# Altium schematic sheet Relay Board_Rev1-2 - Altium.schdoc
size 421 x 304 mm
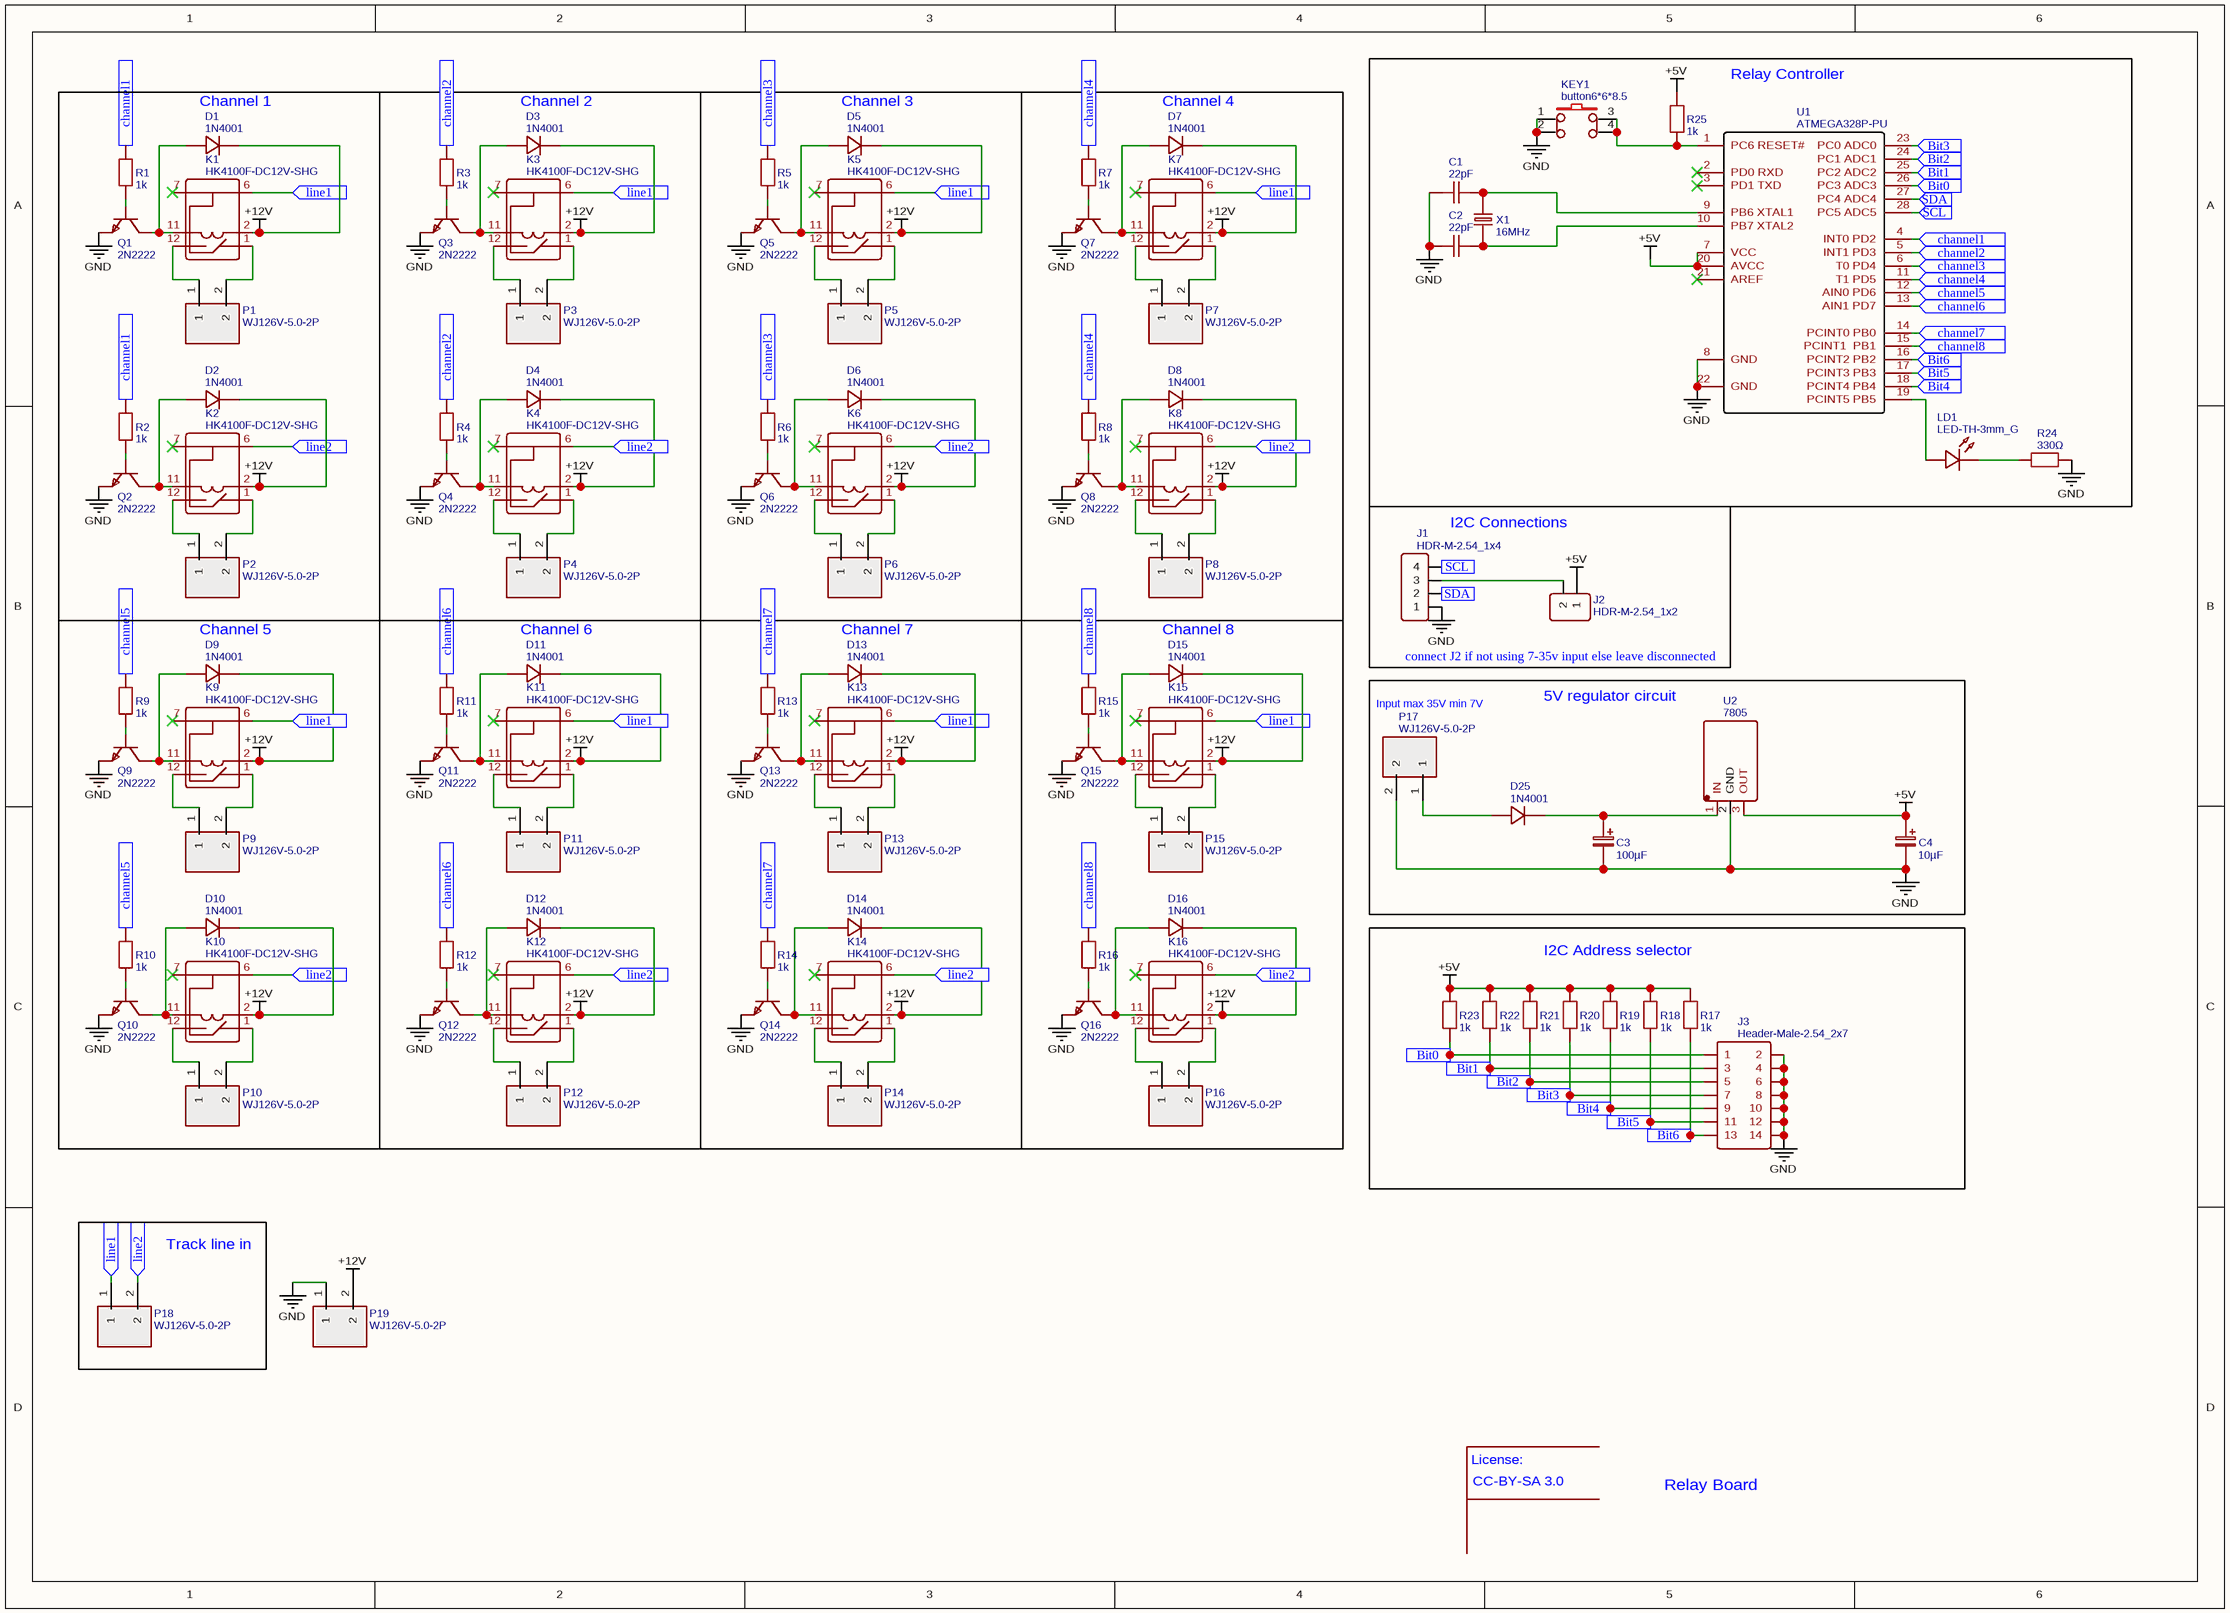
[diagram p0: Relay Board_Rev1-2 - Altium.schdoc]

## Parts
C1  22pF  [RAD-0.2]
C2  22pF  [RAD-0.2]
C3  100µF  [CAP-D3.0×F1.5]
C4  10µF  [CAP-D3.0×F1.5]
D1  1N4001  [DO-41_BD2.4-L4.7-P8.70-D0.9-RD]
D2  1N4001  [DO-41_BD2.4-L4.7-P8.70-D0.9-RD]
D3  1N4001  [DO-41_BD2.4-L4.7-P8.70-D0.9-RD]
D4  1N4001  [DO-41_BD2.4-L4.7-P8.70-D0.9-RD]
D5  1N4001  [DO-41_BD2.4-L4.7-P8.70-D0.9-RD]
D6  1N4001  [DO-41_BD2.4-L4.7-P8.70-D0.9-RD]
D7  1N4001  [DO-41_BD2.4-L4.7-P8.70-D0.9-RD]
D8  1N4001  [DO-41_BD2.4-L4.7-P8.70-D0.9-RD]
D9  1N4001  [DO-41_BD2.4-L4.7-P8.70-D0.9-RD]
D10  1N4001  [DO-41_BD2.4-L4.7-P8.70-D0.9-RD]
D11  1N4001  [DO-41_BD2.4-L4.7-P8.70-D0.9-RD]
D12  1N4001  [DO-41_BD2.4-L4.7-P8.70-D0.9-RD]
D13  1N4001  [DO-41_BD2.4-L4.7-P8.70-D0.9-RD]
D14  1N4001  [DO-41_BD2.4-L4.7-P8.70-D0.9-RD]
D15  1N4001  [DO-41_BD2.4-L4.7-P8.70-D0.9-RD]
D16  1N4001  [DO-41_BD2.4-L4.7-P8.70-D0.9-RD]
D25  1N4001  [DO-41_BD2.4-L4.7-P8.70-D0.9-RD]
J1  HDR-M-2.54_1x4  [HDR-M-2.54_1X4]
J2  HDR-M-2.54_1x2  [HDR-M-2.54_1X2]
J3  Header-Male-2.54_2x7  [HDR-TH_14P-P2.54-V-R2-C7-S2.54]
K1  HK4100F-DC12V-SHG  [RELAY-TH_HK4100F-DC12V-SHG]
K2  HK4100F-DC12V-SHG  [RELAY-TH_HK4100F-DC12V-SHG]
K3  HK4100F-DC12V-SHG  [RELAY-TH_HK4100F-DC12V-SHG]
K4  HK4100F-DC12V-SHG  [RELAY-TH_HK4100F-DC12V-SHG]
K5  HK4100F-DC12V-SHG  [RELAY-TH_HK4100F-DC12V-SHG]
K6  HK4100F-DC12V-SHG  [RELAY-TH_HK4100F-DC12V-SHG]
K7  HK4100F-DC12V-SHG  [RELAY-TH_HK4100F-DC12V-SHG]
K8  HK4100F-DC12V-SHG  [RELAY-TH_HK4100F-DC12V-SHG]
K9  HK4100F-DC12V-SHG  [RELAY-TH_HK4100F-DC12V-SHG]
K10  HK4100F-DC12V-SHG  [RELAY-TH_HK4100F-DC12V-SHG]
K11  HK4100F-DC12V-SHG  [RELAY-TH_HK4100F-DC12V-SHG]
K12  HK4100F-DC12V-SHG  [RELAY-TH_HK4100F-DC12V-SHG]
K13  HK4100F-DC12V-SHG  [RELAY-TH_HK4100F-DC12V-SHG]
K14  HK4100F-DC12V-SHG  [RELAY-TH_HK4100F-DC12V-SHG]
K15  HK4100F-DC12V-SHG  [RELAY-TH_HK4100F-DC12V-SHG]
K16  HK4100F-DC12V-SHG  [RELAY-TH_HK4100F-DC12V-SHG]
KEY1  button6*6*8.5  [KEY-TH_4P-L6.0-W6.0-P4.50]
LD1  LED-TH-3mm_G  [LED-TH_BD3.0_GREEN]
P1  WJ126V-5.0-2P  [WJ126V-5.0-2P]
P2  WJ126V-5.0-2P  [WJ126V-5.0-2P]
P3  WJ126V-5.0-2P  [WJ126V-5.0-2P]
P4  WJ126V-5.0-2P  [WJ126V-5.0-2P]
P5  WJ126V-5.0-2P  [WJ126V-5.0-2P]
P6  WJ126V-5.0-2P  [WJ126V-5.0-2P]
P7  WJ126V-5.0-2P  [WJ126V-5.0-2P]
P8  WJ126V-5.0-2P  [WJ126V-5.0-2P]
P9  WJ126V-5.0-2P  [WJ126V-5.0-2P]
P10  WJ126V-5.0-2P  [WJ126V-5.0-2P]
P11  WJ126V-5.0-2P  [WJ126V-5.0-2P]
P12  WJ126V-5.0-2P  [WJ126V-5.0-2P]
P13  WJ126V-5.0-2P  [WJ126V-5.0-2P]
P14  WJ126V-5.0-2P  [WJ126V-5.0-2P]
P15  WJ126V-5.0-2P  [WJ126V-5.0-2P]
P16  WJ126V-5.0-2P  [WJ126V-5.0-2P]
P17  WJ126V-5.0-2P  [WJ126V-5.0-2P]
P18  WJ126V-5.0-2P  [WJ126V-5.0-2P]
P19  WJ126V-5.0-2P  [WJ126V-5.0-2P]
Q1  2N2222  [TO-92-3_L4.9-W3.7-P1.27-L]
Q2  2N2222  [TO-92-3_L4.9-W3.7-P1.27-L]
Q3  2N2222  [TO-92-3_L4.9-W3.7-P1.27-L]
Q4  2N2222  [TO-92-3_L4.9-W3.7-P1.27-L]
Q5  2N2222  [TO-92-3_L4.9-W3.7-P1.27-L]
Q6  2N2222  [TO-92-3_L4.9-W3.7-P1.27-L]
Q7  2N2222  [TO-92-3_L4.9-W3.7-P1.27-L]
Q8  2N2222  [TO-92-3_L4.9-W3.7-P1.27-L]
Q9  2N2222  [TO-92-3_L4.9-W3.7-P1.27-L]
Q10  2N2222  [TO-92-3_L4.9-W3.7-P1.27-L]
Q11  2N2222  [TO-92-3_L4.9-W3.7-P1.27-L]
Q12  2N2222  [TO-92-3_L4.9-W3.7-P1.27-L]
Q13  2N2222  [TO-92-3_L4.9-W3.7-P1.27-L]
Q14  2N2222  [TO-92-3_L4.9-W3.7-P1.27-L]
Q15  2N2222  [TO-92-3_L4.9-W3.7-P1.27-L]
Q16  2N2222  [TO-92-3_L4.9-W3.7-P1.27-L]
R1  1k  [R_AXIAL-0.4]
R2  1k  [R_AXIAL-0.4]
R3  1k  [R_AXIAL-0.4]
R4  1k  [R_AXIAL-0.4]
R5  1k  [R_AXIAL-0.4]
R6  1k  [R_AXIAL-0.4]
R7  1k  [R_AXIAL-0.4]
R8  1k  [R_AXIAL-0.4]
R9  1k  [R_AXIAL-0.4]
R10  1k  [R_AXIAL-0.4]
R11  1k  [R_AXIAL-0.4]
R12  1k  [R_AXIAL-0.4]
R13  1k  [R_AXIAL-0.4]
R14  1k  [R_AXIAL-0.4]
R15  1k  [R_AXIAL-0.4]
R16  1k  [R_AXIAL-0.4]
R17  1k  [R_AXIAL-0.4]
R18  1k  [R_AXIAL-0.4]
R19  1k  [R_AXIAL-0.4]
R20  1k  [R_AXIAL-0.4]
R21  1k  [R_AXIAL-0.4]
R22  1k  [R_AXIAL-0.4]
R23  1k  [R_AXIAL-0.4]
R24  330Ω  [R_AXIAL-0.4]
R25  1k  [R_AXIAL-0.4]
U1  ATMEGA328P-PU  [DIP-28_L34.6-W7.3-P2.54-LS10.2-BL]
U2  7805  [TO-220-3_L10.0-W4.5-P2.54-L]
X1  16MHz  [HC-49US_L11.5-W4.5-P4.88]

## Blocks framed on the sheet
Relay Controller: C1 C2 KEY1 LD1 R24 R25 U1 X1
Channel 1: D1 D2 K1 K2 P1 P2 Q1 Q2 R1 R2
Channel 2: D3 D4 K3 K4 P3 P4 Q3 Q4 R3 R4
Channel 3: D5 D6 K5 K6 P5 P6 Q5 Q6 R5 R6
Channel 4: D7 D8 K7 K8 P7 P8 Q7 Q8 R7 R8
I2C Connections: J1 J2
Channel 5: D9 D10 K9 K10 P9 P10 Q9 Q10 R9 R10
Channel 6: D11 D12 K11 K12 P11 P12 Q11 Q12 R11 R12
Channel 7: D13 D14 K13 K14 P13 P14 Q13 Q14 R13 R14
Channel 8: D15 D16 K15 K16 P15 P16 Q15 Q16 R15 R16
5V regulator circuit: C3 C4 D25 P17 U2
I2C Address selector: J3 R17-R23
Track line in: P18

## Ports
Bit0 (in), Bit1 (in), Bit2 (in), Bit3 (in), Bit4 (in), Bit5 (in), Bit6 (in), channel1 (in), channel2 (in), channel3 (in), channel4 (in), channel5 (in), channel6 (in), channel7 (in), channel8 (in), line1 (in), line2 (in), SCL (in), SDA (in)

## Nets
+5V: C4.1 J2.1 R17.2 R18.2 R19.2 R20.2 R21.2 R22.2 R23.2 R25.2 U1.7(VCC) U1.20(AVCC) U2.3(OUT)
+12V: D1.1(K) D2.1(K) D3.1(K) D4.1(K) D5.1(K) D6.1(K) D7.1(K) D8.1(K) D9.1(K) D10.1(K) D11.1(K) D12.1(K) D13.1(K) D14.1(K) D15.1(K) D16.1(K) K1.2 K2.2 K3.2 K4.2 K5.2 K6.2 K7.2 K8.2 K9.2 K10.2 K11.2 K12.2 K13.2 K14.2 K15.2 K16.2 P19.2
GND: C1.1 C2.1 C3.2 C4.2 J1.1 J3.2 J3.4 J3.6 J3.8 J3.10 J3.12 J3.14 KEY1.1 KEY1.2 P17.2 P19.1 Q1.1(E) Q2.1(E) Q3.1(E) Q4.1(E) Q5.1(E) Q6.1(E) Q7.1(E) Q8.1(E) Q9.1(E) Q10.1(E) Q11.1(E) Q12.1(E) Q13.1(E) Q14.1(E) Q15.1(E) Q16.1(E) R24.2 U1.8(GND) U1.22(GND) U2.2(GND)
Bit0: J3.1 R23.1 U1.26(PC3_ADC3) ; port Bit0
Bit1: J3.3 R22.1 U1.25(PC2_ADC2) ; port Bit1
Bit2: J3.5 R21.1 U1.24(PC1_ADC1) ; port Bit2
Bit3: J3.7 R20.1 U1.23(PC0_ADC0) ; port Bit3
Bit4: J3.9 R19.1 U1.18(PCINT4_PB4) ; port Bit4
Bit5: J3.11 R18.1 U1.17(PCINT3_PB3) ; port Bit5
Bit6: J3.13 R17.1 U1.16(PCINT2_PB2) ; port Bit6
channel1: R1.2 R2.2 U1.4(INT0_PD2) ; port channel1
channel2: R3.2 R4.2 U1.5(INT1_PD3) ; port channel2
channel3: R5.2 R6.2 U1.6(T0_PD4) ; port channel3
channel4: R7.2 R8.2 U1.11(T1_PD5) ; port channel4
channel5: R9.2 R10.2 U1.12(AIN0_PD6) ; port channel5
channel6: R11.2 R12.2 U1.13(AIN1_PD7) ; port channel6
channel7: R13.2 R14.2 U1.14(PCINT0_PB0) ; port channel7
channel8: R15.2 R16.2 U1.15(PCINT1__PB1) ; port channel8
line1: K1.6 K3.6 K5.6 K7.6 K9.6 K11.6 K13.6 K15.6 P18.1 ; port line1
line2: K2.6 K4.6 K6.6 K8.6 K10.6 K12.6 K14.6 K16.6 P18.2 ; port line2
SCL: J1.4 U1.28(PC5_ADC5) ; port SCL
SDA: J1.2 U1.27(PC4_ADC4) ; port SDA
NetC1_2: C1.2 U1.9(PB6_XTAL1) X1.1
NetC2_2: C2.2 U1.10(PB7_XTAL2) X1.2
NetC3_1: C3.1 D25.1(K) U2.1(IN)
NetD1_2: D1.2(A) K1.11 Q1.3(C)
NetD2_2: D2.2(A) K2.11 Q2.3(C)
NetD3_2: D3.2(A) K3.11 Q3.3(C)
NetD4_2: D4.2(A) K4.11 Q4.3(C)
NetD5_2: D5.2(A) K5.11 Q5.3(C)
NetD6_2: D6.2(A) K6.11 Q6.3(C)
NetD7_2: D7.2(A) K7.11 Q7.3(C)
NetD8_2: D8.2(A) K8.11 Q8.3(C)
NetD9_2: D9.2(A) K9.11 Q9.3(C)
NetD10_2: D10.2(A) K10.11 Q10.3(C)
NetD11_2: D11.2(A) K11.11 Q11.3(C)
NetD12_2: D12.2(A) K12.11 Q12.3(C)
NetD13_2: D13.2(A) K13.11 Q13.3(C)
NetD14_2: D14.2(A) K14.11 Q14.3(C)
NetD15_2: D15.2(A) K15.11 Q15.3(C)
NetD16_2: D16.2(A) K16.11 Q16.3(C)
NetD25_2: D25.2(A) P17.1
NetJ1_3: J1.3 J2.2
NetK1_1: K1.1 P1.2
NetK1_12: K1.12 P1.1
NetK2_1: K2.1 P2.2
NetK2_12: K2.12 P2.1
NetK3_1: K3.1 P3.2
NetK3_12: K3.12 P3.1
NetK4_1: K4.1 P4.2
NetK4_12: K4.12 P4.1
NetK5_1: K5.1 P5.2
NetK5_12: K5.12 P5.1
NetK6_1: K6.1 P6.2
NetK6_12: K6.12 P6.1
NetK7_1: K7.1 P7.2
NetK7_12: K7.12 P7.1
NetK8_1: K8.1 P8.2
NetK8_12: K8.12 P8.1
NetK9_1: K9.1 P9.2
NetK9_12: K9.12 P9.1
NetK10_1: K10.1 P10.2
NetK10_12: K10.12 P10.1
NetK11_1: K11.1 P11.2
NetK11_12: K11.12 P11.1
NetK12_1: K12.1 P12.2
NetK12_12: K12.12 P12.1
NetK13_1: K13.1 P13.2
NetK13_12: K13.12 P13.1
NetK14_1: K14.1 P14.2
NetK14_12: K14.12 P14.1
NetK15_1: K15.1 P15.2
NetK15_12: K15.12 P15.1
NetK16_1: K16.1 P16.2
NetK16_12: K16.12 P16.1
NetKEY1_3: KEY1.3 KEY1.4 R25.1 U1.1(PC6_RESET#)
NetLD1_1: LD1.1 U1.19(PCINT5_PB5)
NetLD1_2: LD1.2 R24.1
NetQ1_2: Q1.2(B) R1.1
NetQ2_2: Q2.2(B) R2.1
NetQ3_2: Q3.2(B) R3.1
NetQ4_2: Q4.2(B) R4.1
NetQ5_2: Q5.2(B) R5.1
NetQ6_2: Q6.2(B) R6.1
NetQ7_2: Q7.2(B) R7.1
NetQ8_2: Q8.2(B) R8.1
NetQ9_2: Q9.2(B) R9.1
NetQ10_2: Q10.2(B) R10.1
NetQ11_2: Q11.2(B) R11.1
NetQ12_2: Q12.2(B) R12.1
NetQ13_2: Q13.2(B) R13.1
NetQ14_2: Q14.2(B) R14.1
NetQ15_2: Q15.2(B) R15.1
NetQ16_2: Q16.2(B) R16.1

Not connected (* = marked no-connect by the designer): K1 7*; K2 7*; K3 7*; K4 7*; K5 7*; K6 7*; K7 7*; K8 7*; K9 7*; K10 7*; K11 7*; K12 7*; K13 7*; K14 7*; K15 7*; K16 7*; U1 2(PD0_RXD)* 3(PD1_TXD)* 21(AREF)*

## Notes on the sheet
- connect J2 if not using 7-35v input else leave disconnected
- Input max 35V min 7V
- License:
- CC-BY-SA 3.0
- Relay Board

## Library data of the parts
C1 C2 = 22pF: nameAlias: Value(F); Contributor: LCEDA_Lib; spicePre: C; spiceSymbolName: C_RAD-0.2_US
C3 = 100µF: nameAlias: Value(F); Contributor: LCEDA_Lib; spicePre: C; spiceSymbolName: CE_TH_D3.0×F1.5_EU
C4 = 10µF: nameAlias: Value(F); Contributor: LCEDA_Lib; spicePre: C; spiceSymbolName: CE_TH_D3.0×F1.5_EU
D1-D16 D25 = 1N4001: BOM_Manufacturer: LRC; BOM_Supplier: LCSC; BOM_Manufacturer Part: 1N4001; BOM_Supplier Part: C82804; spicePre: D; spiceSymbolName: 1N4001
J1 = HDR-M-2.54_1x4: Contributor: LCEDA_Lib; BOM_Supplier Part: C124378; BOM_Supplier: LCSC; spicePre: J; spiceSymbolName: HDR-M-2.54_1x4
J2 = HDR-M-2.54_1x2: Contributor: LCEDA_Lib; BOM_Supplier Part: C124375; BOM_Supplier: LCSC; spicePre: J; spiceSymbolName: HDR-M-2.54_1x2
J3 = Header-Male-2.54_2x7: BOM_Manufacturer: BOOMELE; BOM_Manufacturer Part: Double row of needle2X7P 2.54mm; BOM_Supplier: LCSC; BOM_Supplier Part: C71397; spicePre: J; spiceSymbolName: Header-Male-2.54_2x7
K1-K16 = HK4100F-DC12V-SHG: BOM_Manufacturer: HUIKE; BOM_Supplier: LCSC; BOM_Manufacturer Part: HK4100F-DC12V-SHG; image: //image.lceda.cn/szlcsc/C13467.jpg; BOM_Supplier Part: C13467; spicePre: K; spiceSymbolName: HK4100F-DC12V-SHG
KEY1 = button6*6*8.5: BOM_Manufacturer: ReliaPro; BOM_Supplier Part: C59980; BOM_Supplier: LCSC; BOM_Manufacturer Part: button6*6*8.5; image: http://image.lceda.cn/szlcsc/C59980.jpg; spicePre: K; spiceSymbolName: button6*6*8.5
LD1 = LED-TH-3mm_G: BOM_Manufacturer: EVERLIGHT(台湾亿光); BOM_Manufacturer Part: 204-10SYGD/S530-E3; Contributor: LCEDA_Lib; BOM_Supplier Part: C85161; spicePre: L; spiceSymbolName: LED-TH-3mm_G
P1-P19 = WJ126V-5.0-2P: BOM_Manufacturer: ReliaPro; BOM_Supplier: LCSC; BOM_Manufacturer Part: WJ126V-5.0-2P; image: //image.lceda.cn/szlcsc/C8404.jpg; BOM_Supplier Part: C8404; spicePre: P; spiceSymbolName: WJ126V-5.0-2P
Q1-Q16 = 2N2222: BOM_Manufacturer: SEMTECH; Contributor: LCSC; BOM_Supplier: LCSC; BOM_Manufacturer Part: 2N2222; BOM_Supplier Part: C118536; spicePre: Q; spiceSymbolName: 2N2222
R1-R23 R25 = 1k: nameAlias: Value(Ω); Contributor: LCEDA_Lib; spicePre: R; spiceSymbolName: R_AXIAL-0.4_EU
R24 = 330Ω: nameAlias: Value(Ω); Contributor: LCEDA_Lib; spicePre: R; spiceSymbolName: R_AXIAL-0.4_EU
U1 = ATMEGA328P-PU: BOM_Manufacturer: MICROCHIP; sourceId: Oic6oiASL; Contributor: LCSC; timeStamp: 1451725987; BOM_Supplier: LCSC; BOM_Manufacturer Part: ATMEGA328P-PU; image: //image.lceda.cn/szlcsc/C33901.jpg; BOM_Supplier Part: C33901; spicePre: U; spiceSymbolName: ATMEGA328P-PU
U2 = 7805: BOM_Manufacturer: Foshan Blue Rocket Elec; Contributor: LCSC; BOM_Supplier: LCSC; BOM_Supplier Part: C305416; BOM_Manufacturer Part: 7805; spicePre: U; spiceSymbolName: 7805
X1 = 16MHz: BOM_Manufacturer: TAITIEN Elec; BOM_Manufacturer Part: XIHCELNANF-16MHZ; nameAlias: Frequency; Contributor: LCSC; BOM_Supplier: LCSC; BOM_Supplier Part: C295075; spicePre: X; spiceSymbolName: XIHCELNANF-16MHZ